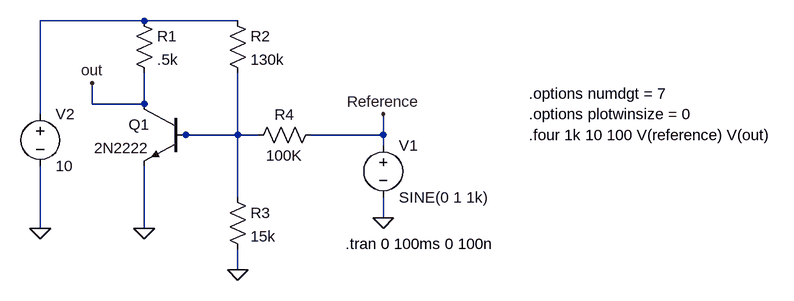
[diagram p0: schematic Draft1.asc]
Draft1.asc, the LTspice schematic file:
Version 4
SHEET 1 880 680
WIRE -272 -48 -432 -48
WIRE -128 -48 -272 -48
WIRE -352 80 -352 48
WIRE -272 80 -272 32
WIRE -272 80 -352 80
WIRE -432 96 -432 -48
WIRE -208 128 -224 128
WIRE -128 128 -128 32
WIRE -128 128 -208 128
WIRE -96 128 -128 128
WIRE 96 128 96 96
WIRE 96 128 -16 128
WIRE 96 144 96 128
WIRE -128 224 -128 128
WIRE 96 256 96 224
WIRE -432 272 -432 176
WIRE -272 272 -272 176
WIRE -128 336 -128 304
FLAG 96 256 0
FLAG 96 96 Reference
FLAG -432 272 0
FLAG -272 272 0
FLAG -128 336 0
FLAG -352 48 out
SYMBOL voltage 96 128 R0
WINDOW 123 0 0 Left 0
WINDOW 39 0 0 Left 0
SYMATTR InstName V1
SYMATTR Value SINE(0 1 1k)
SYMBOL res -288 -64 R0
SYMATTR InstName R1
SYMATTR Value .5k
SYMBOL res -144 -64 R0
SYMATTR InstName R2
SYMATTR Value 130k
SYMBOL res -144 208 R0
SYMATTR InstName R3
SYMATTR Value 15k
SYMBOL voltage -432 80 R0
WINDOW 123 0 0 Left 0
WINDOW 39 0 0 Left 0
SYMATTR InstName V2
SYMATTR Value 10
SYMBOL npn -208 80 M0
SYMATTR InstName Q1
SYMATTR Value 2N2222
SYMBOL res 0 112 R90
WINDOW 0 0 56 VBottom 2
WINDOW 3 32 56 VTop 2
SYMATTR InstName R4
SYMATTR Value 100K
TEXT 38 296 Left 2 !.tran 0 100ms 0 100n
TEXT 320 64 Left 2 !.options numdgt = 7
TEXT 320 96 Left 2 !.options plotwinsize = 0
TEXT 320 128 Left 2 !.four 1k 10 100 V(reference) V(out)

The netlist it stands for:
* Draft1.asc
V1 Reference 0 SINE(0 1 1k)
R1 N001 out .5k
R2 N001 N002 130k
R3 N002 0 15k
V2 N001 0 10
Q1 out N002 0 0 2N2222
R4 Reference N002 100K
.model NPN NPN
.model PNP PNP
.lib standard.bjt
.tran 0 100ms 0 100n
.options numdgt = 7
.options plotwinsize = 0
.four 1k 10 100 V(reference) V(out)
.backanno
.end